# Altium project Wireless_charger_stm8.PrjPcb
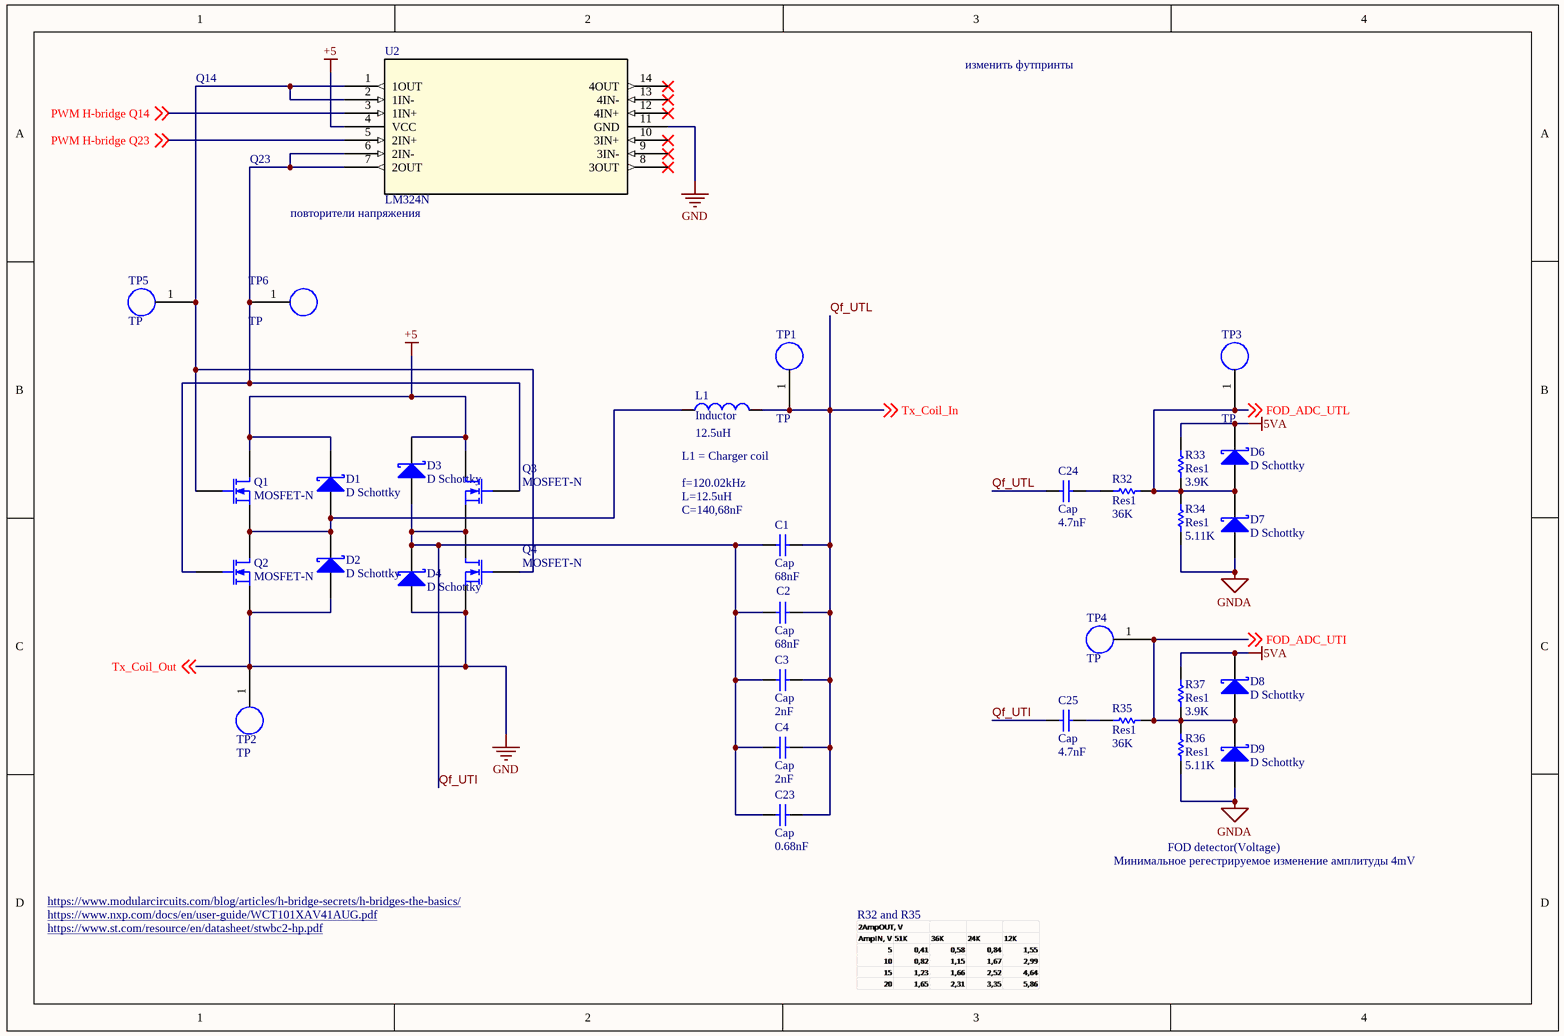
[diagram p0: H-Bridge.SchDoc]
3 sheets, 114 parts. Net scope: global (net labels, ports and power ports of the same name join across sheets).
Board file: PCB1.PcbDoc
Sheets:
  H-Bridge.SchDoc
  ASK_Demodulation_and_thermistor_control.SchDoc
  MSU_and_periphery.SchDoc

## Sheet H-Bridge.SchDoc
size A4; SheetNumber: 1; SheetTotal: 3

### Parts
C1  Cap  value 68nF  [CAP 0603_1608]
C2  Cap  value 68nF  [CAP 0603_1608]
C3  Cap  value 2nF  [CAP 0603_1608]
C4  Cap  value 2nF  [CAP 0603_1608]
C23  Cap  value 0.68nF  [CAP 0603_1608]
C24  Cap  value 4.7nF  [CAP 0402_1005]
C25  Cap  value 4.7nF  [CAP 0402_1005]
D1  D Schottky  [SOD-123]
D2  D Schottky  [SOD-123]
D3  D Schottky  [SOD-123]
D4  D Schottky  [SOD-123]
D6  D Schottky  [SOD-123]
D7  D Schottky  [SOD-123]
D8  D Schottky  [SOD-123]
D9  D Schottky  [SOD-123]
L1  Inductor  value 12.5uH  [Charger_Coil1]
Q1  MOSFET-N  [DIODES SOT-23-3]
Q2  MOSFET-N  [DIODES SOT-23-3]
Q3  MOSFET-N  [DIODES SOT-23-3]
Q4  MOSFET-N  [DIODES SOT-23-3]
R32  Res1  value 36K  [RES 0402_1005]
R33  Res1  value 3.9K  [RES 0402_1005]
R34  Res1  value 5.11K  [RES 0603_1608]
R35  Res1  value 36K  [RES 0402_1005]
R36  Res1  value 5.11K  [RES 0603_1608]
R37  Res1  value 3.9K  [RES 0402_1005]
TP1  TP  [Testpoint1]  (no BOM)
TP2  TP  [Testpoint1]  (no BOM)
TP3  TP  [Testpoint1]  (no BOM)
TP4  TP  [Testpoint1]  (no BOM)
TP5  TP  [Testpoint1]  (no BOM)
TP6  TP  [Testpoint1]  (no BOM)
U2  LM324N  [LM324NSR]

### Nets
+5: D1.2(K) D3.2(K) D6.2(K) D8.2(K) Q1.1(D) Q3.1(D) R33.1 R37.2 U2.4(VCC)  [also labelled 5VA]
GND: D2.1(A) D4.1(A) D7.1(A) D9.1(A) Q2.3(S) Q4.3(S) R34.1 R36.1 TP2.1 U2.11(GND) ; off-sheet Tx_Coil_Out  [also labelled GNDA, Tx_Coil_Out]
FOD_ADC_UTI: D8.1(A) D9.2(K) R35.2 R36.2 R37.1 TP4.1 ; off-sheet FOD_ADC_UTI
FOD_ADC_UTL: D6.1(A) D7.2(K) R32.1 R33.2 R34.2 TP3.1 ; off-sheet FOD_ADC_UTL
PWM H-bridge Q14: U2.3(1IN+) ; off-sheet PWM H-bridge Q14
PWM H-bridge Q23: U2.5(2IN+) ; off-sheet PWM H-bridge Q23
Qf_UTI: C1.1 C2.1 C3.1 C4.1 C23.2 C25.1 D3.1(A) D4.2(K) Q3.3(S) Q4.1(D)
Qf_UTL: C1.2 C2.2 C3.2 C4.2 C23.1 C24.1 L1.2 TP1.1 ; off-sheet Tx_Coil_In  [also labelled Tx_Coil_In]
NetC24_2: C24.2 R32.2
NetC25_2: C25.2 R35.1
NetD1_1: D1.1(A) D2.2(K) L1.1 Q1.3(S) Q2.1(D)
NetQ1_2: Q1.2(G) Q4.2(G) TP5.1 U2.1(1OUT) U2.2(1IN-)
NetQ2_2: Q2.2(G) Q3.2(G) TP6.1 U2.6(2IN-) U2.7(2OUT)

Not connected (* = marked no-connect by the designer): U2 8(3OUT)* 9(3IN-)* 10(3IN+)* 12(4IN+)* 13(4IN-)* 14(4OUT)*

### Notes on the sheet
- Q14
- изменить футпринты
- Q23
- (near U2) повторители напряжения
- (near L1) L1 = Charger coil
- (near C1) C=140,68nF
- f=120.02kHz
- L=12.5uH
- FOD detector(Voltage)
- https://www.modularcircuits.com/blog/articles/h-bridge-secrets/h-bridges-the-basics/
- https://www.nxp.com/docs/en/user-guide/WCT101XAV41AUG.pdf
- R32 and R35
- Минимальное регестрируемое изменение амплитуды 4mV
- https://www.st.com/resource/en/datasheet/stwbc2-hp.pdf

### Library data of the parts
C1-C4 C23-C25 = Cap: Capacitor; Published: 8-Jun-2000; LatestRevisionDate: 17-Jul-2002; LatestRevisionNote: Re-released for DXP Platform.; PackageReference: RAD-0.3; Publisher: Altium Limited; PackageDescription: Radial Cap, Thru-Hole; 2 Leads; 0.3 in Pin Spacing
D1-D4 D6-D9 = D Schottky: Schottky Diode; Published: 8-Jun-2000; LatestRevisionDate: 17-Jul-2002; LatestRevisionNote: Re-released for DXP Platform.; PackageReference: SMB; Publisher: Altium Limited; PackageDescription: DO-214-AA/SMB; 2 C-Bend Leads; Body 5.3 x 3.6 mm, inc. leads (LxW); Code_JEDEC: DO-214-AA
L1 = Inductor: Code_IEC: 1005; Published: 8-Jun-2000; LatestRevisionDate: 29-May-2009; LatestRevisionNote: IPC-7351 Footprint Added.; PackageReference: 0402-A; Publisher: Altium Limited; PackageDescription: Chip Inductor; Code_JEITA: 0402
Q1-Q4 = MOSFET-N: N-Channel MOSFET; Published: 8-Jun-2000; LatestRevisionDate: 17-Jul-2002; LatestRevisionNote: Re-released for DXP Platform.; PackageVersion: 1995/1996; PackageReference: E3; Publisher: Altium Limited; PackageDescription: TO, Flat Index; 3 In-Line, Axial Leads; Body Dia. 4.6mm; Lead Dia. 0.5 mm (max)
R32-R37 = Res1: Resistor; Published: 8-Jun-2000; LatestRevisionDate: 17-Jul-2002; LatestRevisionNote: Re-released for DXP Platform.; PackageReference: AXIAL-0.3; Publisher: Altium Limited; PackageDescription: Axial Device, Thru-Hole; 2 Leads; 0.3 in Pin Spacing
TP1-TP6 = Testpoint1
U2 = LM324N: No Description Available; Mfr_Name: Texas Instruments; RefDes: RefDes; Type: Type

## Sheet ASK_Demodulation_and_thermistor_control.SchDoc
size A4; SheetNumber: 2; SheetTotal: 3
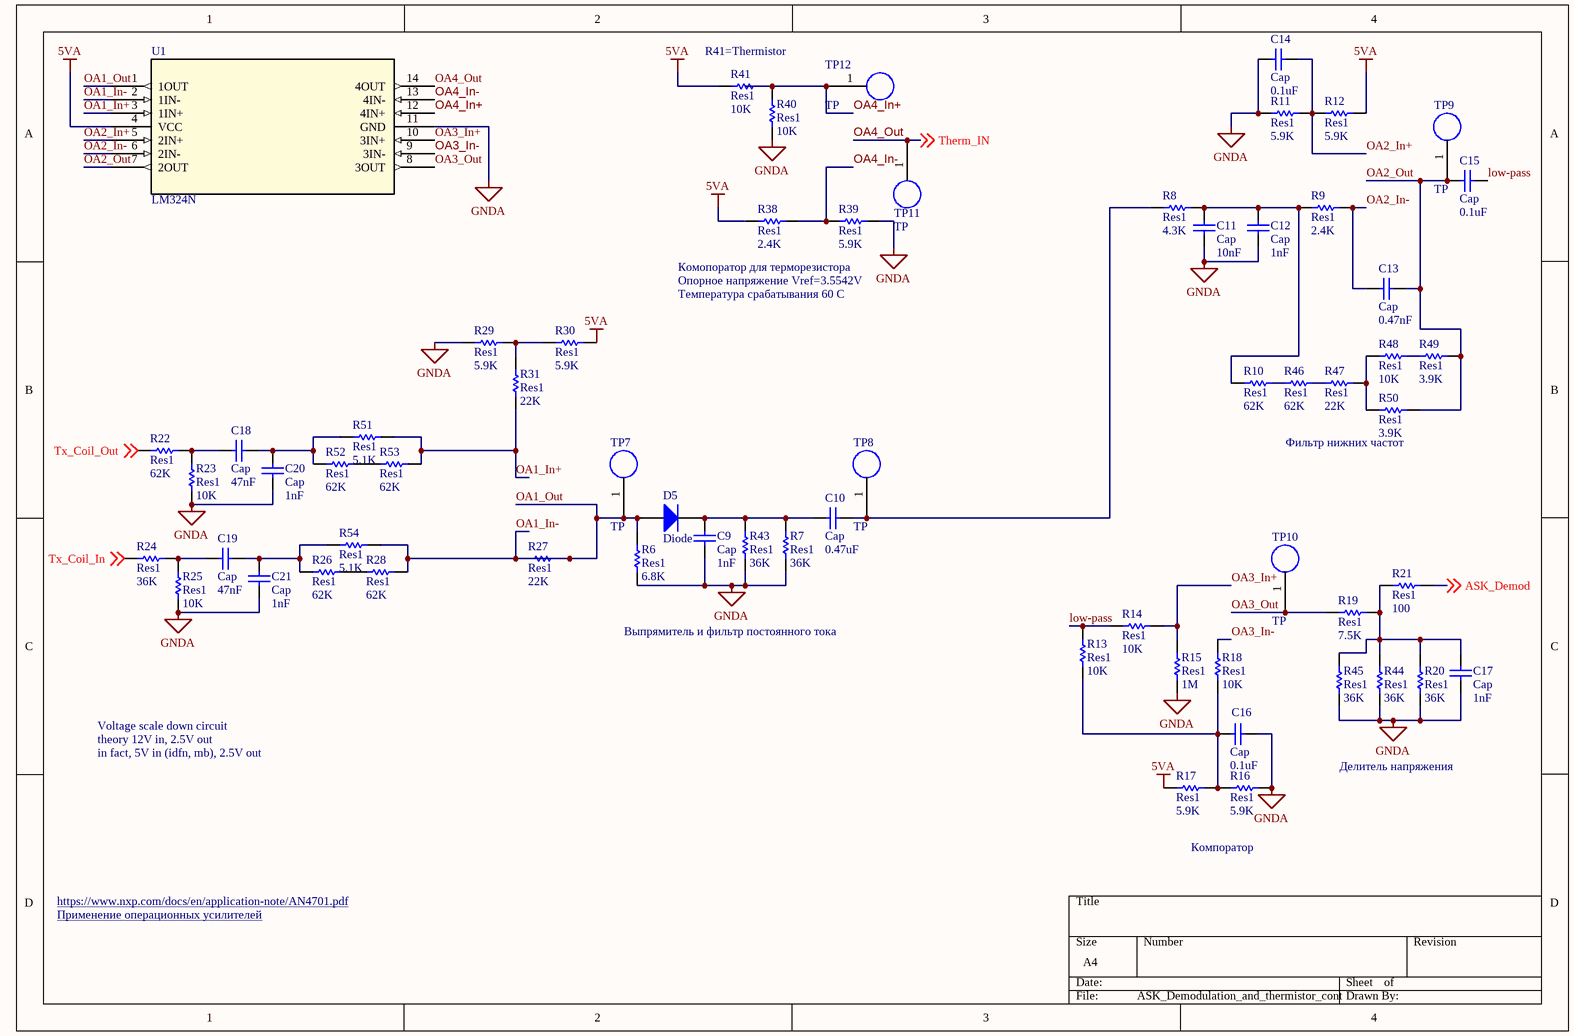
[diagram p1: ASK_Demodulation_and_thermistor_control.SchDoc]

### Parts
C9  Cap  value 1nF  [CAP 0402_1005]
C10  Cap  value 0.47uF  [CAP 0402_1005]
C11  Cap  value 10nF  [CAP 0402_1005]
C12  Cap  value 1nF  [CAP 0402_1005]
C13  Cap  value 0.47nF  [CAP 0402_1005]
C14  Cap  value 0.1uF  [CAP 0402_1005]
C15  Cap  value 0.1uF  [CAP 0402_1005]
C16  Cap  value 0.1uF  [CAP 0402_1005]
C17  Cap  value 1nF  [CAP 0402_1005]
C18  Cap  value 47nF  [CAP 0402_1005]
C19  Cap  value 47nF  [CAP 0402_1005]
C20  Cap  value 1nF  [CAP 0402_1005]
C21  Cap  value 1nF  [CAP 0402_1005]
D5  Diode  [SOD-123]
R6  Res1  value 6.8K  [RES 0402_1005]
R7  Res1  value 36K  [RES 0402_1005]
R8  Res1  value 4.3K  [RES 0402_1005]
R9  Res1  value 2.4K  [RES 0402_1005]
R10  Res1  value 62K  [RES 0402_1005]
R11  Res1  value 5.9K  [RES 0603_1608]
R12  Res1  value 5.9K  [RES 0603_1608]
R13  Res1  value 10K  [RES 0402_1005]
R14  Res1  value 10K  [RES 0402_1005]
R15  Res1  value 1M  [RES 0402_1005]
R16  Res1  value 5.9K  [RES 0603_1608]
R17  Res1  value 5.9K  [RES 0603_1608]
R18  Res1  value 10K  [RES 0402_1005]
R19  Res1  value 7.5K  [RES 0402_1005]
R20  Res1  value 36K  [RES 0402_1005]
R21  Res1  value 100  [RES 0402_1005]
R22  Res1  value 62K  [RES 0402_1005]
R23  Res1  value 10K  [RES 0402_1005]
R24  Res1  value 36K  [RES 0402_1005]
R25  Res1  value 10K  [RES 0402_1005]
R26  Res1  value 62K  [RES 0402_1005]
R27  Res1  value 22K  [RES 0402_1005]
R28  Res1  value 62K  [RES 0402_1005]
R29  Res1  value 5.9K  [RES 0603_1608]
R30  Res1  value 5.9K  [RES 0603_1608]
R31  Res1  value 22K  [RES 0402_1005]
R38  Res1  value 2.4K  [RES 0402_1005]
R39  Res1  value 5.9K  [RES 0603_1608]
R40  Res1  value 10K  [RES 0402_1005]
R41  Res1  value 10K  [RES 0402_1005]
R43  Res1  value 36K  [RES 0402_1005]
R44  Res1  value 36K  [RES 0402_1005]
R45  Res1  value 36K  [RES 0402_1005]
R46  Res1  value 62K  [RES 0402_1005]
R47  Res1  value 22K  [RES 0402_1005]
R48  Res1  value 10K  [RES 0402_1005]
R49  Res1  value 3.9K  [RES 0402_1005]
R50  Res1  value 3.9K  [RES 0402_1005]
R51  Res1  value 5.1K  [RES 0402_1005]
R52  Res1  value 62K  [RES 0402_1005]
R53  Res1  value 62K  [RES 0402_1005]
R54  Res1  value 5.1K  [RES 0402_1005]
TP7  TP  [Testpoint1]  (no BOM)
TP8  TP  [Testpoint1]  (no BOM)
TP9  TP  [Testpoint1]  (no BOM)
TP10  TP  [Testpoint1]  (no BOM)
TP11  TP  [Testpoint1]  (no BOM)
TP12  TP  [Testpoint1]  (no BOM)
U1  LM324N  [LM324NSR]

### Nets
5VA: R12.2 R17.1 R30.2 R38.1 R41.1 U1.4(VCC)  [project net +5]
GNDA: C9.2 C11.1 C12.2 C14.1 C16.2 C17.2 C20.1 C21.2 R6.2 R7.2 R11.1 R15.2 R16.2 R20.1 R22.2 R23.2 R25.1 R29.2 R39.2 R40.1 R43.2 R44.1 R45.1 U1.11(GND) ; off-sheet Tx_Coil_Out  [also labelled Tx_Coil_Out]  [project net GND]
ASK_Demod: R21.2 ; off-sheet ASK_Demod
low-pass: C15.2 R13.2 R14.1
OA1_In+: R31.2 R51.2 R53.2 U1.3(1IN+)
OA1_In-: D5.1(A) R6.1 R27.1 R27.2 R28.2 R54.2 TP7.1 U1.1(1OUT) U1.2(1IN-)  [also labelled OA1_Out]
OA2_In+: C14.2 R11.2 R12.1 U1.5(2IN+)
OA2_In-: C13.1 R9.2 U1.6(2IN-)
OA2_Out: C13.2 C15.1 R49.2 R50.2 TP9.1 U1.7(2OUT)
OA3_In+: R14.2 R15.1 U1.10(3IN+)
OA3_In-: R18.2 U1.9(3IN-)
OA3_Out: R19.1 TP10.1 U1.8(3OUT)
OA4_In+: R40.2 R41.2 TP12.1 U1.12(4IN+)
OA4_In-: R38.2 R39.1 U1.13(4IN-)
OA4_Out: TP11.1 U1.14(4OUT) ; off-sheet Therm_IN  [also labelled Therm_IN]
Tx_Coil_In: R24.1 ; off-sheet Tx_Coil_In  [project net Qf_UTL]
NetC9_1: C9.1 C10.1 D5.2(K) R7.1 R43.1
NetC10_2: C10.2 R8.2 TP8.1
NetC11_2: C11.2 C12.1 R8.1 R9.1 R10.1
NetC16_1: C16.1 R13.1 R16.1 R17.2 R18.1
NetC17_1: C17.1 R19.2 R20.2 R21.1 R44.2 R45.2
NetC18_1: C18.1 R22.1 R23.1
NetC18_2: C18.2 C20.2 R51.1 R52.1
NetC19_1: C19.1 R24.2 R25.2
NetC19_2: C19.2 C21.1 R26.1 R54.1
NetR10_2: R10.2 R46.1
NetR26_2: R26.2 R28.1
NetR29_1: R29.1 R30.1 R31.1
NetR46_2: R46.2 R47.1
NetR47_2: R47.2 R48.1 R50.1
NetR48_2: R48.2 R49.1
NetR52_2: R52.2 R53.1

### Notes on the sheet
- R41=Thermistor
- Опорное напряжение Vref=3.5542V
- Комопоратор для терморезистора
- Температура срабатывания 60 С
- (near R50) Фильтр нижних частот
- Выпрямитель и фильтр постоянного тока
- Voltage scale down circuit
- theory 12V in, 2.5V out
- in fact, 5V in (idfn, mb), 2.5V out
- Делитель напряжения
- Компоратор
- https://www.nxp.com/docs/en/application-note/AN4701.pdf
- Применение операционных усилителей <https://ru.wikipedia.org/wiki/%D0%9F%D1%80%D0%B8%D0%BC%D0%B5%D0%BD%D0%B5%D0%BD%D0%B8%D0%B5_%D0%BE%D0%BF%D0%B5%D1%80%D0%B0%D1%86%D0%B8%D0%BE%D0%BD%D0%BD%D1%8B%D1%85_%D1%83%D1%81%D0%B8%D0%BB%D0%B8%D1%82%D0%B5%D0%BB%D0%B5%D0%B9>

### Library data of the parts
C9-C21 = Cap: Capacitor; Published: 8-Jun-2000; LatestRevisionDate: 17-Jul-2002; LatestRevisionNote: Re-released for DXP Platform.; PackageReference: RAD-0.3; Publisher: Altium Limited; PackageDescription: Radial Cap, Thru-Hole; 2 Leads; 0.3 in Pin Spacing
D5 = Diode: Default Diode; Published: 8-Jun-2000; LatestRevisionDate: 17-Jul-2002; LatestRevisionNote: Re-released for DXP Platform.; PackageVersion: Sep-1996; PackageReference: SMC; Publisher: Altium Limited; PackageDescription: DO-214-AB/SMC; 2 C-Bend Leads; Body 7.9 x 5.9 mm, inc. leads (LxW); Code_JEDEC: DO-214-AB
R6-R31 R38-R41 R43-R54 = Res1: Resistor; Published: 8-Jun-2000; LatestRevisionDate: 17-Jul-2002; LatestRevisionNote: Re-released for DXP Platform.; PackageReference: AXIAL-0.3; Publisher: Altium Limited; PackageDescription: Axial Device, Thru-Hole; 2 Leads; 0.3 in Pin Spacing
TP7-TP12 = Testpoint1
U1 = LM324N: as U2 on sheet H-Bridge; RefDes: RefDes; Type: Type

## Sheet MSU_and_periphery.SchDoc
size A4; SheetNumber: 3; SheetTotal: 3
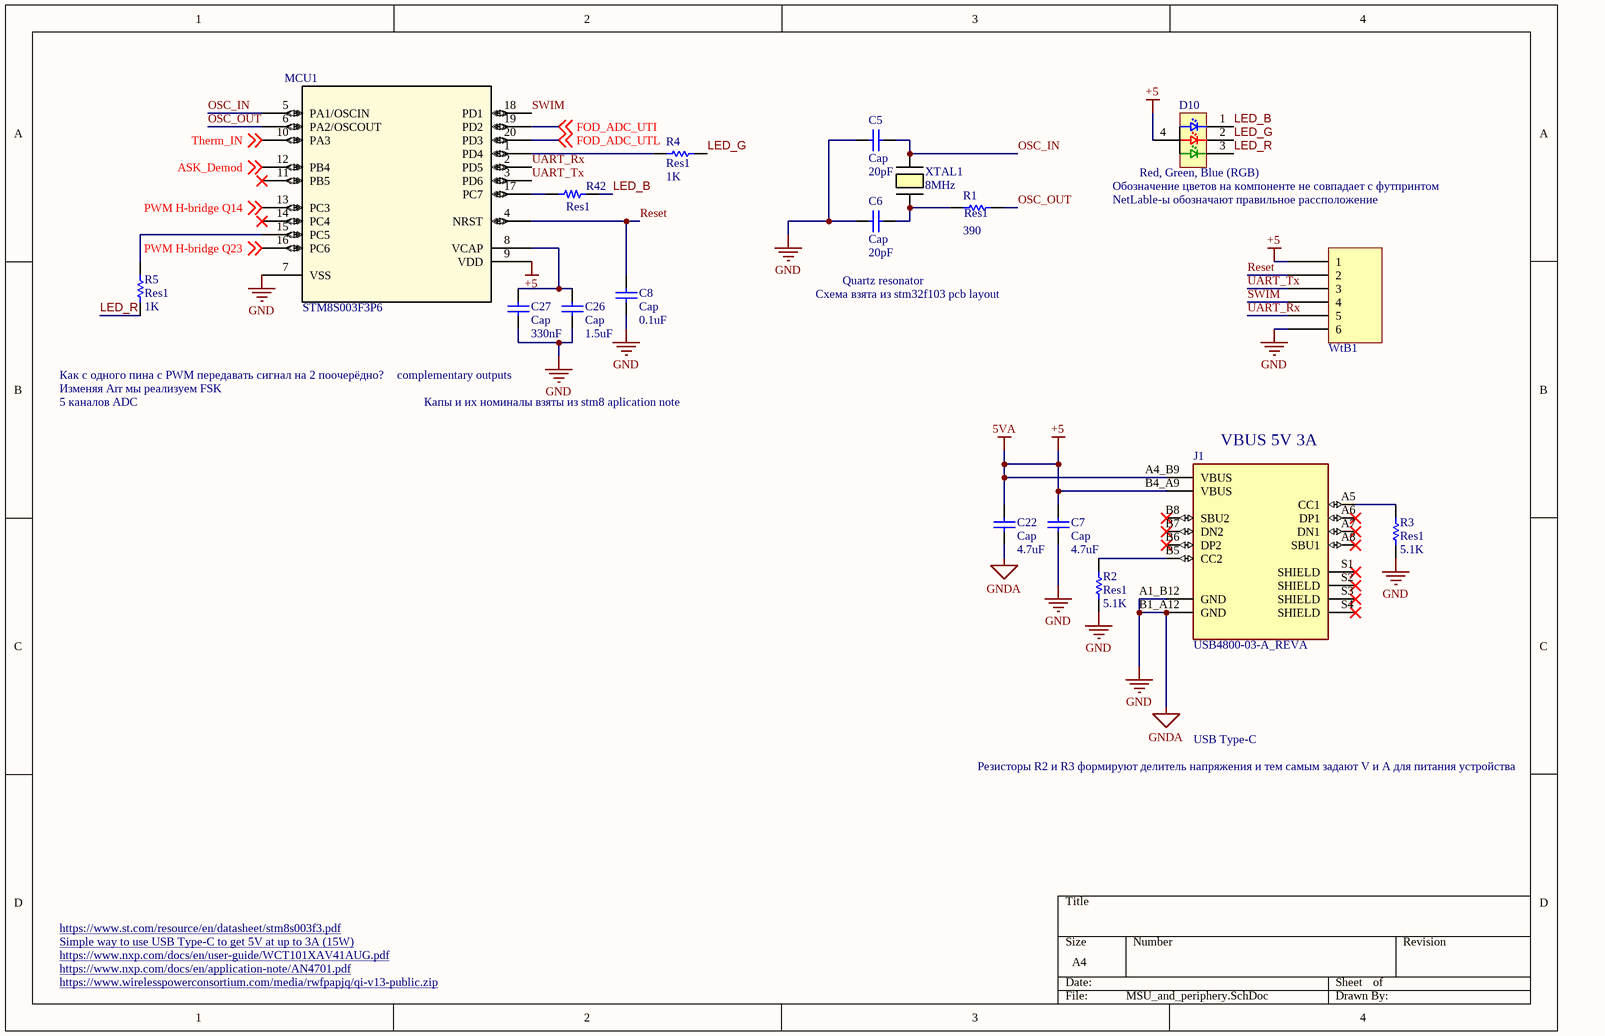
[diagram p2: MSU_and_periphery.SchDoc]

### Parts
C5  Cap  value 20pF  [CAP 0402_1005]
C6  Cap  value 20pF  [CAP 0402_1005]
C7  Cap  value 4.7uF  [CAP 0402_1005]
C8  Cap  value 0.1uF  [CAP 0402_1005]
C22  Cap  value 4.7uF  [CAP 0402_1005]
C26  Cap  value 1.5uF  [CAP 0603_1608]
C27  Cap  value 330nF  [CAP 0603_1608]
D10  Red, Green, Blue (RGB)  [Citizen CL-505S-X-SD-T]
J1  USB4800-03-A_REVA  [GCT_USB4800-03-A_REVA]
MCU1  STM8S003F3P6  [TSSOP20]
R1  Res1  value 390  [RES 0603_1608]
R2  Res1  value 5.1K  [RES 0402_1005]
R3  Res1  value 5.1K  [RES 0402_1005]
R4  Res1  value 1K  [RES 0402_1005]
R5  Res1  value 1K  [RES 0402_1005]
R42  Res1  [RES 0402_1005]
WtB1  (no value)  [6W_connector]  (no BOM)
XTAL1  8MHz  [NDK NX5032GA]

### Nets
+5: C7.1 C22.1 D10.4(A3) J1.A4_B9(VBUS) J1.B4_A9(VBUS) MCU1.9(VDD) WtB1.1  [also labelled 5VA]
GND: C5.2 C6.2 C7.2 C8.1 C22.2 C26.2 C27.1 J1.A1_B12(GND) J1.B1_A12(GND) MCU1.7(VSS) R2.2 R3.2 WtB1.6  [also labelled GNDA]
ASK_Demod: MCU1.12(PB4) ; off-sheet ASK_Demod
FOD_ADC_UTI: MCU1.19(PD2) ; off-sheet FOD_ADC_UTI
FOD_ADC_UTL: MCU1.20(PD3) ; off-sheet FOD_ADC_UTL
LED_B: D10.1(C1) R42.2
LED_G: D10.2(C2) R4.1
LED_R: D10.3(C3) R5.1
OSC_IN: C5.1 MCU1.5(PA1/OSCIN) XTAL1.1
OSC_OUT: MCU1.6(PA2/OSCOUT) R1.2
PWM H-bridge Q14: MCU1.13(PC3) ; off-sheet PWM H-bridge Q14
PWM H-bridge Q23: MCU1.16(PC6) ; off-sheet PWM H-bridge Q23
Reset: C8.2 MCU1.4(NRST) WtB1.2
SWIM: MCU1.18(PD1) WtB1.4
Therm_IN: MCU1.10(PA3) ; off-sheet Therm_IN  [project net OA4_Out]
UART_Rx: MCU1.2(PD5) WtB1.5
UART_Tx: MCU1.3(PD6) WtB1.3
NetC6_1: C6.1 R1.1 XTAL1.2
NetC26_1: C26.1 C27.2 MCU1.8(VCAP)
NetJ1_A5: J1.A5(CC1) R3.1
NetJ1_B5: J1.B5(CC2) R2.1
NetMCU1_1: MCU1.1(PD4) R4.2
NetMCU1_15: MCU1.15(PC5) R5.2
NetMCU1_17: MCU1.17(PC7) R42.1

Not connected (* = marked no-connect by the designer): J1 A6(DP1)* A7(DN1)* A8(SBU1)* B6(DP2)* B7(DN2)* B8(SBU2)* S1(SHIELD)* S2(SHIELD)* S3(SHIELD)* S4(SHIELD)*; MCU1 11(PB5)* 14(PC4)*

### Notes on the sheet
- (near D10) Обозначение цветов на компоненте не совпадает с футпринтом
- NetLable-ы обозначают правильное рассположение
- Схема взята из stm32f103 pcb layout
- Quartz resonator
- Как с одного пина с PWM передавать сигнал на 2 поочерёдно?
- complementary outputs
- Изменяя Arr мы реализуем FSK
- 5 каналов ADC
- Капы и их номиналы взяты из stm8 aplication note
- (near J1) VBUS 5V 3A
- Резисторы R2 и R3 формируют делитель напряжения и тем самым задают V и A для питания устройства
- USB Type-C
- https://www.nxp.com/docs/en/application-note/AN4701.pdf
- https://www.nxp.com/docs/en/user-guide/WCT101XAV41AUG.pdf
- Simple way to use USB Type-C to get 5V at up to 3A (15W) <https://forum.digikey.com/t/simple-way-to-use-usb-type-c-to-get-5v-at-up-to-3a-15w/7016>
- https://www.st.com/resource/en/datasheet/stm8s003f3.pdf
- https://www.wirelesspowerconsortium.com/media/rwfpapjq/qi-v13-public.zip

### Library data of the parts
C5-C8 C22 C26 C27 = Cap: Capacitor; Published: 8-Jun-2000; LatestRevisionDate: 17-Jul-2002; LatestRevisionNote: Re-released for DXP Platform.; PackageReference: RAD-0.3; Publisher: Altium Limited; PackageDescription: Radial Cap, Thru-Hole; 2 Leads; 0.3 in Pin Spacing
D10 = CL-505S-X-SD-T: LED TRI TOP FIRING 1.0 X 1.0; Manufacturer: Citizen; Configuration: Common Anode; Current - Test: 5mA Red, 5mA Green, 5mA Blue; Lens Color: 0.26mm; Lens Size: 1.00mm; Lens Style: Square with Flat Top; Millicandela Rating: 40mcd Red, 220mcd Green, 65mcd Blue; Voltage - Forward (Vf) (Typ): 1.85V Red, 2.7V Green, 2.75V Blue; Wavelength - Dominant: 615nm Red, 530nm Green, 470nm Blue; Part Number: CL-505S-X-SD-T; Color: Red, Green, Blue (RGB); ComponentLink1Description: Datasheet; ComponentLink1URL: http://ce.citizen.co.jp/up_img/product/sQNrj4RlM7o2/CL-505S_e.pdf; ComponentLink2Description: DigiKey Link; ComponentLink2URL: http://digikey.com/product-detail/en/citizen/CL-505S-X-SD-T/1642-1510-1-ND/6005950; Device Package: 0404 (1010 Metric); Height (Max): 0.26mm; LastUpdated: 19.03.2020 22:25:23; Lifecycle Status: Active; Minimum Order: 1; Mounting Type: Surface Mount; Package / Case: 0404 (1010 Metric); Packaging: TapeAndReel; PartId: 955; Part Status: Active; Price: 0.23; Series: CL-505S; Size / Dimension: 1.00mm L x 1.00mm W; Supplier 1: DigiKey; Supplier Part Number 1: 1642-1510-1-ND; Value: Red, Green, Blue (RGB)
J1 = USB4800-03-A_REVA: USB-C (USB TYPE-C) USB 2.0 Receptacle Connector 24 (16+8 Dummy) Position Surface Mount, Right Angle; Through Hole; MF: Global Connector Technology; SnapEDA_Link: https://www.snapeda.com/parts/USB4800-03-A/Global+Connector+Technology/view-part/?ref=snap; Package: None; MP: USB4800-03-A; Check_prices: https://www.snapeda.com/parts/USB4800-03-A/Global+Connector+Technology/view-part/?ref=eda; Purchase-URL: https://pricing.snapeda.com/search/part/USB4800-03-A/?ref=eda; Price: None; Value: *; Availability: In Stock
MCU1 = STM8S003F3P6: No Description Available; Mfr_Name: STMicroelectronics; RefDes: RefDes; Type: Type
R1-R5 = Res1: Resistor; Published: 8-Jun-2000; LatestRevisionDate: 17-Jul-2002; LatestRevisionNote: Re-released for DXP Platform.; PackageReference: AXIAL-0.3; Publisher: Altium Limited; PackageDescription: Axial Device, Thru-Hole; 2 Leads; 0.3 in Pin Spacing
R42 = 5112: 0402 JUMPER ON TAPE AND REEL; Manufacturer: Keystone Electronics; Power (Watts): 0.5W, 1/2W; Part Number: 5112; ComponentLink1Description: Datasheet; ComponentLink1URL: http://www.keystoneelectronics.net/ENG._DEPT/WEB_ORACLE/PDF/PDF%20CAT%20NO%20DRAWINGS/5000-5999/5112.PDF; ComponentLink2Description: DigiKey Link; ComponentLink2URL: http://digikey.com/product-detail/en/keystone-electronics/5112/36-5112-1-ND/9921855; Composition: Metal Element; Device Package: 0402 (1005 Metric); Height - Seated (Max): 0.020" (0.50mm); LastUpdated: 02.09.2020 1:07:49; Lifecycle Status: Active; Minimum Order: 1; Number of Terminations: 2; Package / Case: 0402 (1005 Metric); Packaging: TapeAndReel; PartId: 12597; Part Status: Active; Price: 0.19; Series: -; Size / Dimension: 0.039" L x 0.020" W (1.00mm x 0.50mm); Supplier 1: DigiKey; Supplier Part Number 1: 36-5112-1-ND; Supplier Device Package: 0402; Tolerance: Jumper
WtB1 = WtB_6_connector: Wire to board connector 6pin
XTAL1 = ECS-80-18-5PX-TR

## Nets that join several sheets
+5: H-Bridge (9 pins), ASK_Demodulation_and_thermistor_control (6 pins), MSU_and_periphery (7 pins)
GND: H-Bridge (10 pins), ASK_Demodulation_and_thermistor_control (24 pins), MSU_and_periphery (13 pins)
ASK_Demod: ASK_Demodulation_and_thermistor_control (R21.2), MSU_and_periphery (MCU1.12)
FOD_ADC_UTI: H-Bridge (6 pins), MSU_and_periphery (MCU1.19)
FOD_ADC_UTL: H-Bridge (6 pins), MSU_and_periphery (MCU1.20)
OA4_Out: ASK_Demodulation_and_thermistor_control (TP11.1 U1.14), MSU_and_periphery (MCU1.10)
PWM H-bridge Q14: H-Bridge (U2.3), MSU_and_periphery (MCU1.13)
PWM H-bridge Q23: H-Bridge (U2.5), MSU_and_periphery (MCU1.16)
Qf_UTL: H-Bridge (8 pins), ASK_Demodulation_and_thermistor_control (R24.1)